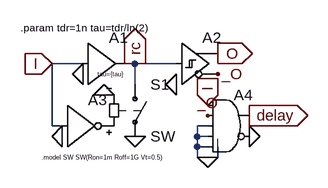
[diagram p0: schematic delay-rc-rise.asc]
delay-rc-rise.asc, the LTspice schematic file:
Version 4
SHEET 1 880 680
WIRE 144 160 96 160
WIRE 224 160 208 160
WIRE 288 160 224 160
WIRE 224 192 224 160
WIRE 96 256 96 160
WIRE 112 256 96 256
WIRE 336 256 320 256
WIRE 320 272 320 256
WIRE 336 272 320 272
WIRE 320 288 320 272
WIRE 336 288 320 288
WIRE 320 304 320 288
WIRE 336 304 320 304
WIRE 352 304 352 288
WIRE 352 304 336 304
FLAG 144 176 0
FLAG 288 192 0
FLAG 352 144 O
IOPIN 352 144 Out
FLAG 96 160 I
IOPIN 96 160 In
FLAG 176 208 0
FLAG 224 272 0
FLAG 112 272 0
FLAG 336 304 0
FLAG 400 272 0
FLAG 336 224 I
IOPIN 336 224 In
FLAG 336 240 _O
FLAG 352 176 _O
FLAG 400 240 delay
IOPIN 400 240 Out
FLAG 224 160 rc
IOPIN 224 160 Out
SYMBOL Digital\\buf1 144 96 R0
WINDOW 3 22 80 Left 0
SYMATTR Value tau={tau}
SYMATTR InstName A1
SYMBOL sw 224 176 R0
SYMATTR InstName S1
SYMBOL Digital\\inv 112 192 R0
SYMATTR InstName A3
SYMBOL Digital\\and 368 192 R0
SYMATTR InstName A4
SYMBOL Digital\\schmitt 288 96 R0
SYMATTR InstName A2
TEXT 48 104 Left 1 !.param tdr=1n tau=tdr/ln(2)
TEXT 80 304 Left 0 !.model SW SW(Ron=1m Roff=1G Vt=0.5)

The netlist it stands for:
* delay-rc-rise.asc
A1 I 0 0 0 0 0 rc 0 BUF tau={tau}
S1 rc 0 P001 0 SW
A3 I 0 0 0 0 P001 0 0 BUF
A4 I _O 0 0 0 0 delay 0 AND
A2 rc 0 0 0 0 _O O 0 SCHMITT
.param tdr=1n tau=tdr/ln(2)
.model SW SW(Ron=1m Roff=1G Vt=0.5)
.backanno
.end